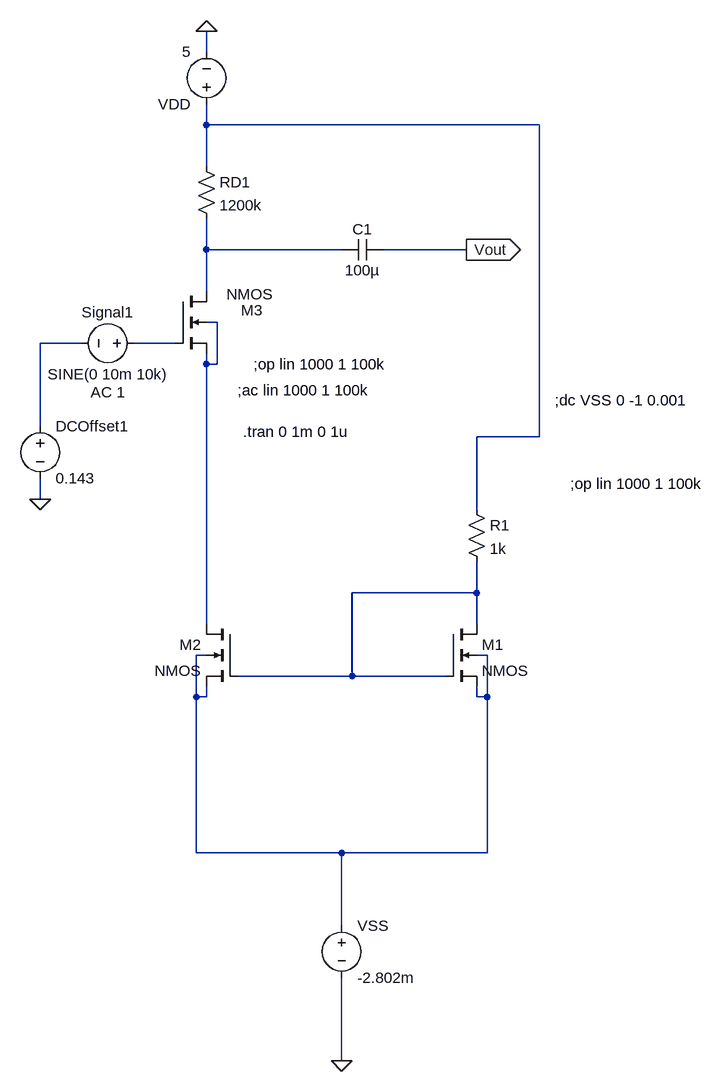
[diagram p0: schematic Current Source.asc]
Current Source.asc, the LTspice schematic file:
Version 4
SHEET 1 880 1316
WIRE -736 -256 -736 -288
WIRE -736 -144 -736 -176
WIRE -224 -144 -736 -144
WIRE -736 -80 -736 -144
WIRE -736 48 -736 0
WIRE -528 48 -736 48
WIRE -336 48 -464 48
WIRE -736 112 -736 48
WIRE -720 160 -736 160
WIRE -928 192 -992 192
WIRE -784 192 -848 192
WIRE -736 224 -736 208
WIRE -720 224 -720 160
WIRE -720 224 -736 224
WIRE -992 320 -992 192
WIRE -224 336 -224 -144
WIRE -224 336 -320 336
WIRE -992 432 -992 400
WIRE -320 448 -320 336
WIRE -320 576 -320 528
WIRE -320 576 -512 576
WIRE -736 624 -736 224
WIRE -320 624 -320 576
WIRE -736 672 -752 672
WIRE -304 672 -320 672
WIRE -512 704 -512 576
WIRE -512 704 -688 704
WIRE -368 704 -512 704
WIRE -752 736 -752 672
WIRE -736 736 -736 720
WIRE -736 736 -752 736
WIRE -320 736 -320 720
WIRE -304 736 -304 672
WIRE -304 736 -320 736
WIRE -752 976 -752 736
WIRE -528 976 -752 976
WIRE -304 976 -304 736
WIRE -304 976 -528 976
WIRE -528 1088 -528 976
WIRE -528 1296 -528 1168
FLAG -528 1296 0
FLAG -736 -288 0
FLAG -992 432 0
FLAG -336 48 Vout
IOPIN -336 48 Out
SYMBOL nmos4 -368 624 R0
SYMATTR InstName M1
SYMATTR Value2 l=0.18u w=1.8u
SYMBOL nmos4 -688 624 M0
SYMATTR InstName M2
SYMATTR Value2 l=0.18u w=1.8u
SYMBOL res -336 432 R0
SYMATTR InstName R1
SYMATTR Value 1k
SYMBOL voltage -528 1072 R0
WINDOW 123 0 0 Left 0
WINDOW 39 0 0 Left 0
SYMATTR InstName VSS
SYMATTR Value -2.802m
SYMBOL res -752 -96 R0
SYMATTR InstName RD1
SYMATTR Value 1200k
SYMBOL nmos4 -784 112 R0
WINDOW 0 101 29 Left 2
WINDOW 3 79 5 Left 2
SYMATTR InstName M3
SYMATTR Value2 l=0.18u w=1.8u
SYMBOL voltage -736 -160 R180
WINDOW 123 0 0 Left 0
WINDOW 39 0 0 Left 0
SYMATTR InstName VDD
SYMATTR Value 5
SYMBOL voltage -992 304 R0
WINDOW 123 0 0 Left 0
WINDOW 39 0 0 Left 0
SYMATTR InstName DCOffset1
SYMATTR Value 0.143
SYMBOL voltage -832 192 R90
WINDOW 0 -32 56 VBottom 2
WINDOW 3 32 56 VTop 2
WINDOW 123 60 56 VTop 2
WINDOW 39 0 0 Left 0
SYMATTR InstName Signal1
SYMATTR Value SINE(0 10m 10k)
SYMATTR Value2 AC 1
SYMBOL cap -464 32 R90
WINDOW 0 0 32 VBottom 2
WINDOW 3 32 32 VTop 2
SYMATTR InstName C1
SYMATTR Value 100µ
TEXT -200 280 Left 2 !;dc VSS 0 -1 0.001
TEXT -176 408 Left 2 !;op lin 1000 1 100k
TEXT -688 264 Left 2 !;ac lin 1000 1 100k
TEXT -680 328 Left 2 !.tran 0 1m 0 1u
TEXT -664 224 Left 2 !;op lin 1000 1 100k

The netlist it stands for:
* Current Source.asc
M1 N006 N006 N007 N007 NMOS l=0.18u w=1.8u
M2 N003 N006 N007 N007 NMOS l=0.18u w=1.8u
R1 N001 N006 1k
VSS N007 0 -2.802m
RD1 N001 N002 1200k
M3 N002 N005 N003 N003 NMOS l=0.18u w=1.8u
VDD N001 0 5
V§DCOffset1 N004 0 0.143
V§Signal1 N005 N004 SINE(0 10m 10k) AC 1
C1 Vout N002 100µ
.model NMOS NMOS
.model PMOS PMOS
.lib standard.mos
;dc VSS 0 -1 0.001
;op lin 1000 1 100k
;ac lin 1000 1 100k
.tran 0 1m 0 1u
;op lin 1000 1 100k
.backanno
.end